# EAGLE design module_v1 (EAGLE 6.4)
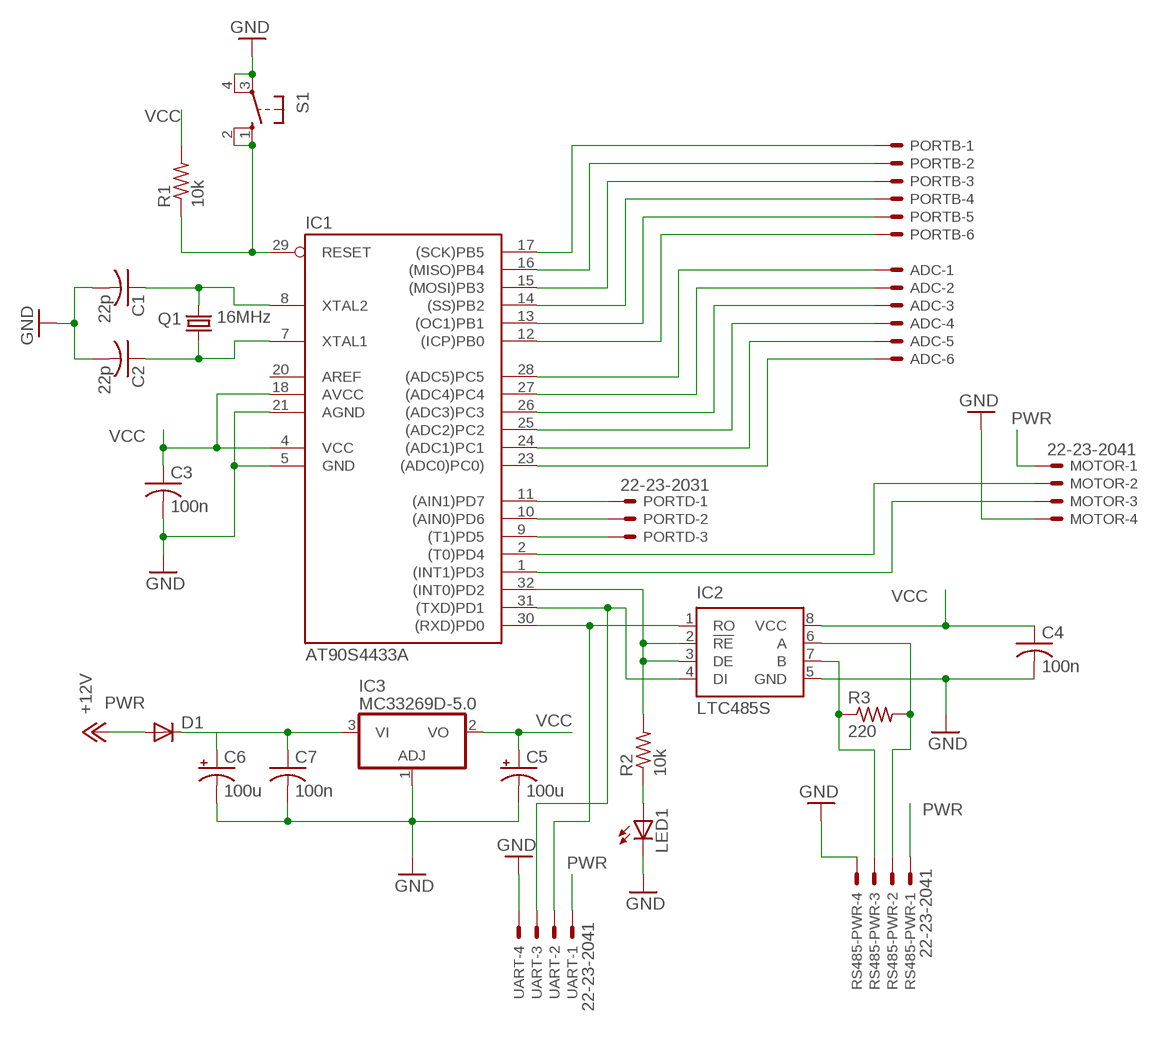
[diagram p0: schematic, sheet 1]

## Parts
ADC  22-23-2061  [22-23-2061]
C1  22p  C-USC0805  [C0805]
C2  22p  C-USC0805  [C0805]
C3  100n  C-USC0805  [C0805]
C4  100n  C-USC0805  [C0805]
C5  100u  CPOL-USD  [PANASONIC_D]
C6  100u  CPOL-USD  [PANASONIC_D]
C7  100n  C-USC0805  [C0805]
D1  DIODE-SMB  [SMB]
IC1  AT90S4433A  [TQFP32-08]
IC2  LTC485S  [SOIC8]
IC3  MC33269D-5.0  [DPACK]
LED1  LEDCHIP-LED0805  [CHIP-LED0805]
MOTOR  22-23-2041  [22-23-2041]
PORTB  22-23-2061  [22-23-2061]
PORTD  22-23-2031  [22-23-2031]
Q1  16MHz  CRYSTALHC49S  [HC49/S]
R1  10k  R-US_R0805  [R0805]
R2  10k  R-US_R0805  [R0805]
R3  220  R-US_R0805  [R0805]
RS485-PWR  22-23-2041  [22-23-2041]
S1  10-XX  [B3F-10XX]
UART  22-23-2041  [22-23-2041]

## Nets
GND: C1.2 C2.2 C3.2 C4.2 C5.- C6.- C7.2 IC1.5(GND) IC1.21(AGND) IC2.5(GND) IC3.1(ADJ) LED1.C MOTOR.4 RS485-PWR.4 S1.3(P) S1.4(P1) UART.4
N$1: IC1.29(RESET) R1.1 S1.1(S) S1.2(S1)
N$2: C2.1 IC1.7(XTAL1) Q1.1
N$3: IC1.32((INT0)PD2) IC2.2(!RE) IC2.3(DE) R2.2
N$4: C1.1 IC1.8(XTAL2) Q1.2
N$5: IC1.30((RXD)PD0) IC2.1(RO) UART.2
N$6: IC1.31((TXD)PD1) IC2.4(DI) UART.3
N$7: IC2.7(B) R3.1 RS485-PWR.3
N$8: IC2.6(A) R3.2 RS485-PWR.2
N$9: LED1.A R2.1
N$10: IC1.1((INT1)PD3) MOTOR.3
N$11: IC1.2((T0)PD4) MOTOR.2
N$12: ADC.6 IC1.23((ADC0)PC0))
N$13: ADC.5 IC1.24((ADC1)PC1)
N$14: ADC.4 IC1.25((ADC2)PC2)
N$15: ADC.3 IC1.26((ADC3)PC3)
N$16: ADC.2 IC1.27((ADC4)PC4)
N$17: ADC.1 IC1.28((ADC5)PC5)
N$18: IC1.12((ICP)PB0) PORTB.6
N$19: IC1.13((OC1)PB1) PORTB.5
N$20: IC1.14((SS)PB2) PORTB.4
N$21: IC1.15((MOSI)PB3) PORTB.3
N$22: IC1.16((MISO)PB4) PORTB.2
N$23: IC1.17((SCK)PB5) PORTB.1
N$24: C6.+ C7.1 D1.C IC3.3(VI)
N$25: IC1.9((T1)PD5) PORTD.3
N$26: IC1.10((AIN0)PD6) PORTD.2
N$27: IC1.11((AIN1)PD7) PORTD.1
PWR: D1.A MOTOR.1 RS485-PWR.1 UART.1 ; supply symbol labelled +12V
VCC: C3.1 C4.1 C5.+ IC1.4(VCC) IC1.18(AVCC) IC2.8(VCC) IC3.2(VO) R1.2
Unconnected: IC1.20(AREF)

## Library data of the parts
ADC PORTB = con-molex:22-23-2061: .100" (2.54mm) Center Header - 6 Pin; MF: MOLEX; MPN: 22-23-2061; OC_FARNELL: 1462922; OC_NEWARK: 27C1933
C1-C4 C7 = rcl:C-US: CAPACITOR, American symbol
C5 C6 = rcl:CPOL-US: POLARIZED CAPACITOR, American symbol
D1 = diode:DIODE-: DIODE
IC1 = atmel:AT90S4433: MICROCONTROLLER 4 Kbytes FLASH 128 bytes SRAM 256 bytes EEPROM UART 6-channel 10 bit ADC; OC_FARNELL: unknown; OC_NEWARK: unknown
IC2 = linear-technology:LTC485: Low Power RS485 Interface Transceiver Source: http://www.linear.com/pc/downloadDocument.do?navId=H0,C1,C1007,C1017,P2064,D1718; OC_FARNELL: unknown; OC_NEWARK: unknown
IC3 = linear:MC33269?*: Adjustable Output Low Dropout Voltage Regulator 800 mA Source: http://www.onsemi.com/pub/Collateral/MC33269-D.PDF
LED1 = led:LED: LED OSRAM: - CHIPLED LG R971, LG N971, LY N971, LG Q971, LY Q971, LO R971, LY R971 LH N974, LH R974 LS Q976, LO Q976, LY Q976 LO Q996 - Hyper CHIPLED LW Q18S LB Q993, LB Q99A, LB R99A - SideLED LS A670, LO A670, LY A670, LG A670, LP A670 LB A673, LV A673, LT A673, LW A673 LH A674 LY A675 LS A676, LA A676, LO A676, LY A676, LW A676 LS A679, LY A679, LG A679 - Hyper Micro SIDELED® LS Y876, LA Y876, LO Y876, LY Y876 LT Y87S - SmartLED LW L88C, LW L88S LB L89C, LB L89S, LG L890 LS L89K, LO L89K, LY L89K LS L896, LA L896, LO L896, LY L896 - TOPLED LS T670, LO T670, LY T670, LG T670, LP T670 LSG T670, LSP T670, LSY T670, LOP T670, LYG T670 LG T671, LOG T671, LSG T671 LB T673, LV T673, LT T673, LW T673 LH T674 LS T676, LA T676, LO T676, LY T676, LB T676, LH T676, LSB T676, LW T676 LB T67C, LV T67C, LT T67C, LS T67K, LO T67K, LY T67K, LW E67C LS E67B, LA E67B, LO E67B, LY E67B, LB E67C, LV E67C, LT E67C LW T67C LS T679, LY T679, LG T679 LS T770, LO T770, LY T770, LG T770, LP T770 LB T773, LV T773, LT T773, LW T773 LH T774 LS E675, LA E675, LY E675, LS T675 LS T776, LA T776, LO T776, LY T776, LB T776 LHGB T686 LT T68C, LB T68C - Hyper Mini TOPLED® LB M676 - Mini TOPLED Santana® LG M470 LS M47K, LO M47K, LY M47K Source: http://www.osram.convergy.de LUXEON: - LUMILED® LXK2-PW12-R00, LXK2-PW12-S00, LXK2-PW14-U00, LXK2-PW14-V00 LXK2-PM12-R00, LXK2-PM12-S00, LXK2-PM14-U00 LXK2-PE12-Q00, LXK2-PE12-R00, LXK2-PE12-S00, LXK2-PE14-T00, LXK2-PE14-U00 LXK2-PB12-K00, LXK2-PB12-L00, LXK2-PB12-M00, LXK2-PB14-N00, LXK2-PB14-P00, LXK2-PB14-Q00 LXK2-PR12-L00, LXK2-PR12-M00, LXK2-PR14-Q00, LXK2-PR14-R00 LXK2-PD12-Q00, LXK2-PD12-R00, LXK2-PD12-S00 LXK2-PH12-R00, LXK2-PH12-S00 LXK2-PL12-P00, LXK2-PL12-Q00, LXK2-PL12-R00 Source: www.luxeon.com KINGBRIGHT: KA-3528ASYC Source: www.kingbright.com
MOTOR RS485-PWR UART = con-molex:22-23-2041: .100" (2.54mm) Center Header - 4 Pin; MF: MOLEX; MPN: 22-23-2041; OC_FARNELL: 1462920; OC_NEWARK: 38C0355
PORTD = con-molex:22-23-2031: .100" (2.54mm) Center Header - 3 Pin; MF: MOLEX; MPN: 22-23-2031; OC_FARNELL: 1462950; OC_NEWARK: 30C0862
Q1 = crystal:CRYSTAL: CRYSTAL; OC_FARNELL: 1667008; OC_NEWARK: unknown
R1-R3 = resistor:R-US_: RESISTOR, American symbol
S1 = switch-omron:10-XX: OMRON SWITCH; MPN: B3F-1000; OC_FARNELL: 176432; OC_NEWARK: 36M3542

## Board
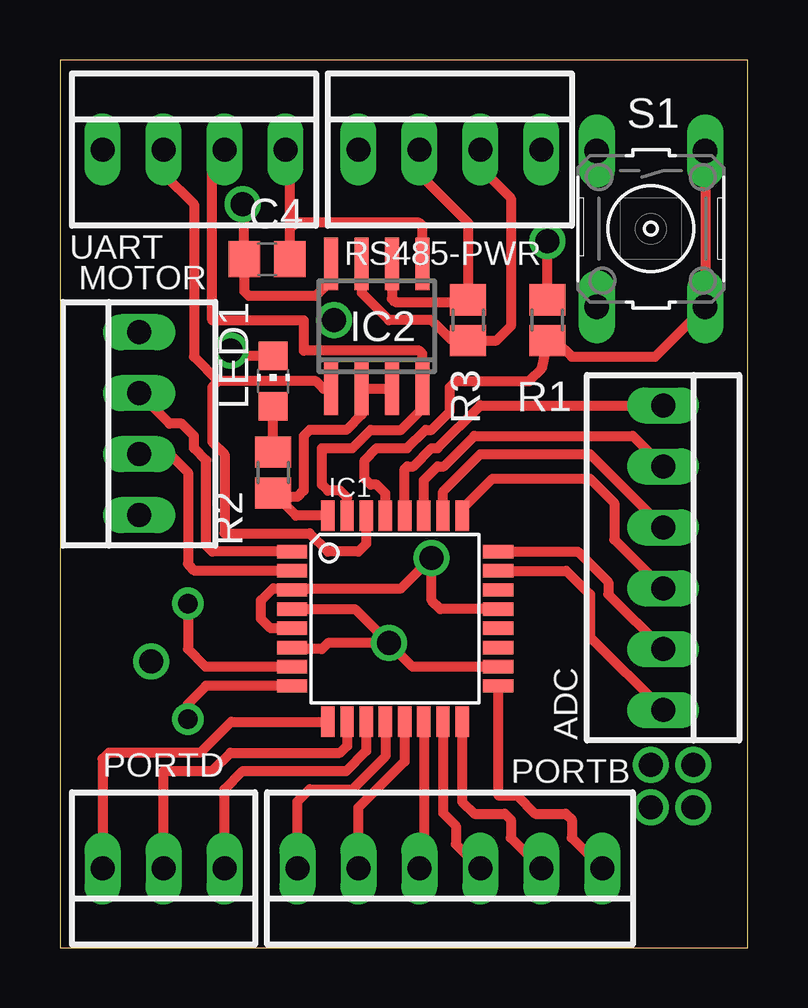
[diagram p1: board, top side]
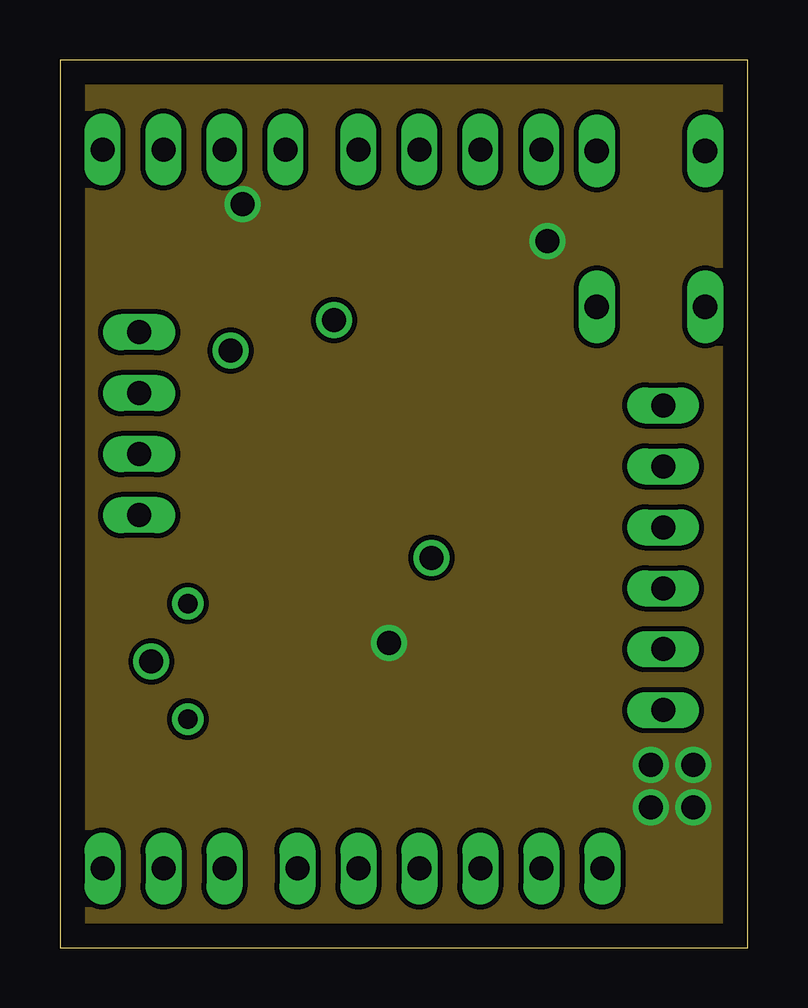
[diagram p2: board, inner layer Route2]
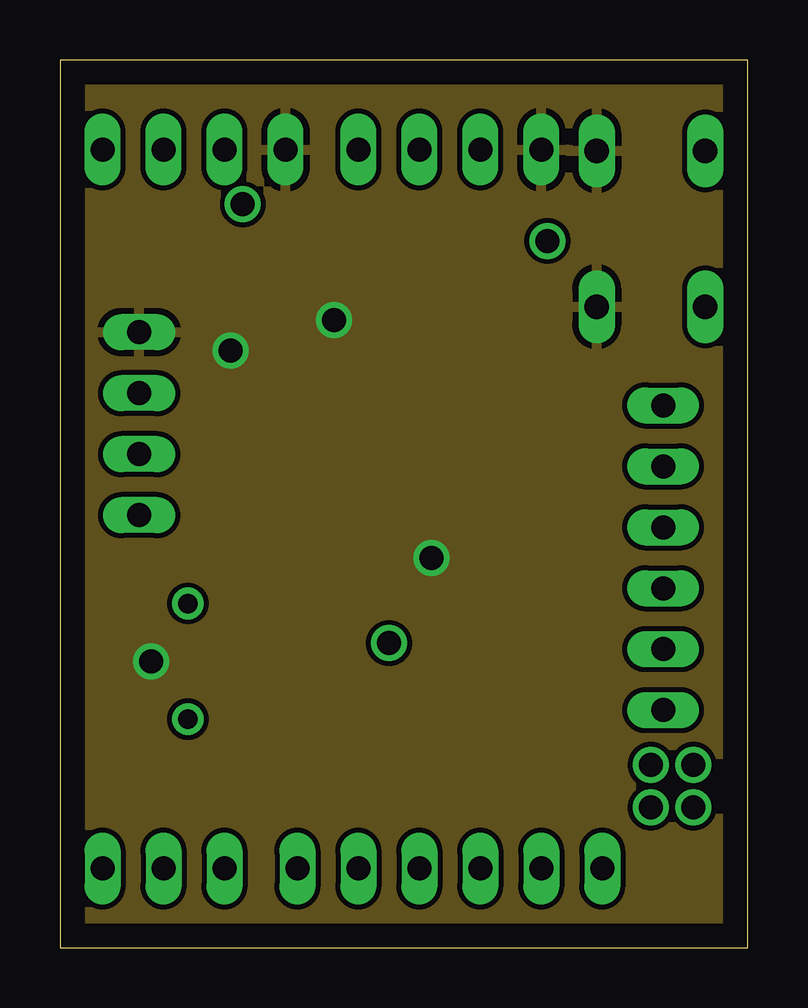
[diagram p3: board, inner layer Route3]
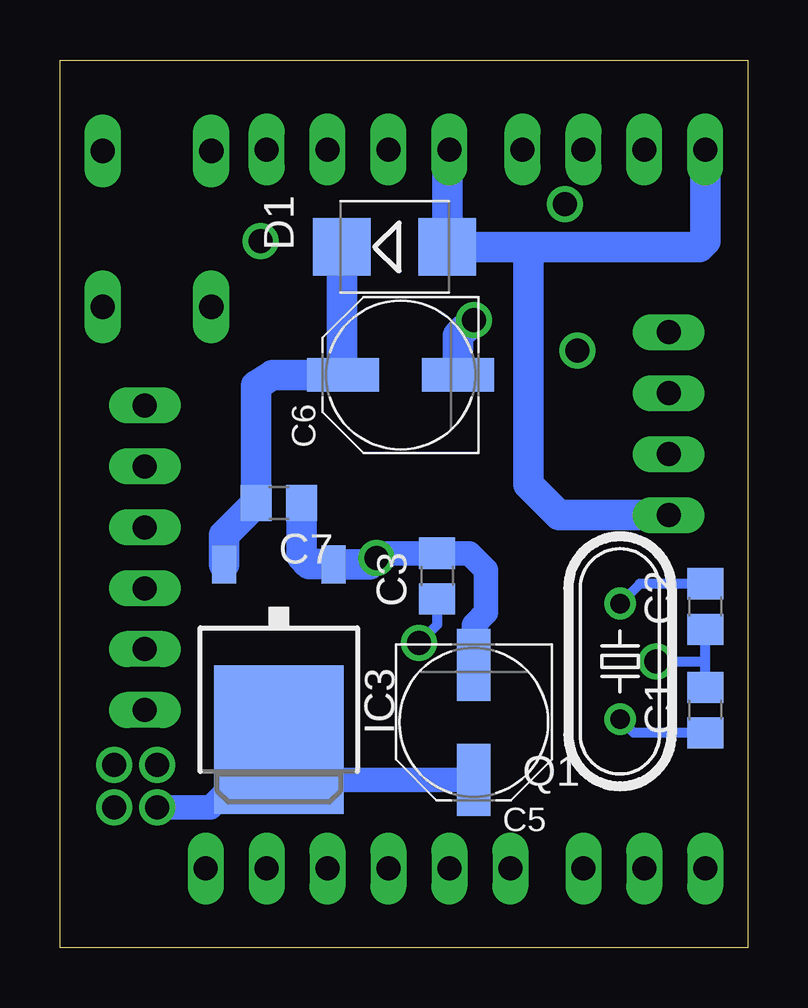
[diagram p4: board, bottom side, seen from below]

Size 28.68 x 37.01 mm. Coordinates in mm from the lower left corner, seen from the top.
Outline: 0,0 28.68,0 28.68,37.01 0,37.01 0,0
Copper layers (1*2*3*16): Top 0.035mm / dielectric 0.35mm / Route2 0.035mm / dielectric 0.35mm / Route3 0.035mm / dielectric 0.35mm / Bottom 0.035mm
Design rules "default *": minimum track width 10mil, minimum drill 24mil, track to track 8mil, track to pad 8mil, pad to pad 8mil, via to via 8mil, smd to smd 8mil, copper to edge 40mil, drill to drill 8mil, minimum pad ring 10mil, minimum via ring 8mil, stop-mask expansion 4mil, vias tented up to drill 0mil, thermal gap 10mil

### Footprints (pad centres in the part's own frame; a part is rotated, then mirrored left to right if it is on the bottom)
22-23-2061 = drill 1 long: 1 -6.35,0; 2 -3.81,0; 3 -1.27,0; 4 1.27,0; 5 3.81,0; 6 6.35,0
C0805 = smd 1.3 x 1.5: 1 -0.95,0; 2 0.95,0
PANASONIC_D = smd 3 x 1.4: + 2.4,0; - -2.4,0
SMB = smd 2.4 x 2.4: A 2.2,0; C -2.2,0
TQFP32-08 = smd 1.27 x 0.559: 1 -4.293,2.8; 2 -4.293,2; 3 -4.293,1.2; 4 -4.293,0.4; 5 -4.293,-0.4; 6 -4.293,-1.2; 7 -4.293,-2; 8 -4.293,-2.8; 17 4.293,-2.8; 18 4.293,-2; 19 4.293,-1.2; 20 4.293,-0.4; 21 4.293,0.4; 22 4.293,1.2; 23 4.293,2; 24 4.293,2.8 | smd 0.559 x 1.27: 9 -2.8,-4.293; 10 -2,-4.293; 11 -1.2,-4.293; 12 -0.4,-4.293; 13 0.4,-4.293; 14 1.2,-4.293; 15 2,-4.293; 16 2.8,-4.293; 25 2.8,4.293; 26 2,4.293; 27 1.2,4.293; 28 0.4,4.293; 29 -0.4,4.293; 30 -1.2,4.293; 31 -2,4.293; 32 -2.8,4.293
SOIC8 = smd 0.6 x 2.2: 1 -1.905,-2.6; 2 -0.635,-2.6; 3 0.635,-2.6; 4 1.905,-2.6; 5 1.905,2.6; 6 0.635,2.6; 7 -0.635,2.6; 8 -1.905,2.6
DPACK = smd 1 x 1.6: 1 -2.28,-4.8; 3 2.28,-4.8 | smd 5.4 x 6.2: 2 0,2.5
CHIP-LED0805 = smd 1.2 x 1.2: A 0,-1.05; C 0,1.05
22-23-2041 = drill 1 long: 1 -3.81,0; 2 -1.27,0; 3 1.27,0; 4 3.81,0
22-23-2031 = drill 1 long: 1 -2.54,0; 2 0,0; 3 2.54,0
HC49/S = drill 0.813: 1 -2.413,0; 2 2.413,0
R0805 = smd 1.3 x 1.5: 1 -0.85,0; 2 0.85,0
B3F-10XX = drill 1.016 long: 1 -3.251,2.261; 2 3.251,2.261; 3 -3.251,-2.261; 4 3.251,-2.261

### Placement (x,y rotation side)
ADC  25.15,16.26 270 top
C1  1.78,9.91 90 bottom
C2  1.78,14.22 270 bottom
C3  12.95,15.49 90 bottom
C4  8.64,28.7 0 top
C5  11.43,9.4 270 bottom
C6  14.48,23.88 180 bottom
C7  19.56,18.54 0 bottom
D1  14.73,29.21 0 bottom
IC1  13.97,13.72 0 top
IC2  13.21,25.91 0 top
IC3  19.56,11.18 180 bottom
LED1  8.89,23.62 0 top
MOTOR  3.3,21.84 90 top
PORTB  16.26,3.3 180 top
PORTD  4.32,3.3 180 top
Q1  5.33,11.94 270 bottom
R1  20.32,26.16 90 top
R2  8.89,19.81 270 top
R3  17.02,26.16 90 top
RS485-PWR  16.26,33.27 0 top
S1  24.64,29.97 270 top
UART  5.59,33.27 0 top

### Tracks (layer width: path | path; a pad name or v marks a point on that pad's centre or on a via)
GND  (via drill 1)
  Top 0.406: LED1.C 7.33,24.67 v7.11,24.89 | C4.2 9.59,29.97 | 9.59,29.97 9.59,33.09 UART.4 | IC2.5 15.11,30.1 14.99,30.23 9.84,30.23 9.59,29.97 | IC1.5 8.78,13.32 8.38,13.72 8.38,14.48 8.89,14.99 14.22,14.99 v15.49,16.26 15.49,14.48 15.86,14.12 IC1.21
  Bottom 0.406: C1.2 1.78,11.94 | 1.78,11.94 C2.2 | v3.81,11.94 1.78,11.94
  Bottom 1.016: 17.78,16 17.3,16 IC3.1 | v15.49,16.26 15.31,16.44 C3.2 11.62,16.44 10.92,15.75 10.92,13.97 11.43,13.46 C5.-
  Bottom 1.27: C7.2 18.61,16.32 18.29,16 17.78,16 | IC3.1 15.77,15.98 v15.49,16.26 | C6.- 12.08,25.51 v11.43,26.16
  pour Route3: 0,37.08 28.45,37.08 28.45,0 0,0
N$1
  Top 0.406: IC1.29 13.57,18.94 13.21,19.3 12.95,19.3 12.7,19.56 12.7,20.32 13.21,20.83 14.48,20.83 15.24,21.59 15.49,21.59 16.26,22.35 16.26,23.37 16.51,23.62 19.56,23.62 20.07,24.13 R1.1 20.66,25.31 21.34,24.64 24.82,24.64 S1.2 S1.1
N$2
  Top 0.406: Q1.1 5.33,12.45 6.06,11.72 IC1.7
  Bottom 0.406: C2.1 4.51,15.17 Q1.1
N$3
  Top 0.406: IC2.3 IC2.2 12.57,22.23 11.94,21.59 10.41,21.59 10.16,21.34 10.16,19.05 9.91,18.8 9.06,18.8 R2.2 9.84,18.01 IC1.32
N$4
  Top 0.406: Q1.2 5.33,10.16 6.09,10.92 IC1.8
  Bottom 0.406: C1.1 4.76,8.96 Q1.2
N$5
  Top 0.406: IC1.30 12.77,16.83 12.45,16.51 11.18,16.51 10.41,17.27 6.86,17.27 6.86,20.57 6.35,21.08 6.35,23.37 6.6,23.62 | IC2.1 10.98,23.31 10.67,23.62 6.6,23.62 | UART.2 4.32,32.26 5.59,30.99 5.59,24.64 6.6,23.62
N$6
  Top 0.406: IC1.31 11.97,18.76 11.68,19.05 11.18,19.05 10.92,19.3 10.92,20.83 12.19,20.83 12.95,21.59 14.22,21.59 15.11,22.48 IC2.4 15.11,24.77 14.99,24.89 10.16,24.89 10.16,26.16 6.35,26.16 6.35,32.77 UART.3
N$7
  Top 0.406: RS485-PWR.3 17.53,32.51 18.8,31.24 18.8,25.91 18.2,25.31 R3.1 16.34,25.31 15.49,26.16 13.72,26.16 12.57,27.3 IC2.7
N$8
  Top 0.406: IC2.6 13.84,27.05 13.97,26.92 16.93,26.92 R3.2 17.02,30.23 14.99,32.26 RS485-PWR.2
N$9
  Top 0.406: R2.1 LED1.A
N$10
  Top 0.406: IC1.1 6.34,16.52 6.1,16.76 6.1,20.32 5.59,20.83 5.59,21.34 5.08,21.84 4.57,21.84 MOTOR.3
N$11
  Top 0.406: MOTOR.2 4.57,20.57 5.33,19.81 5.33,16 5.62,15.72 IC1.2
N$12
  Top 0.406: IC1.23 21.11,15.72 22.1,14.73 22.1,12.95 ADC.6
N$13
  Top 0.406: IC1.24 21.58,16.52 22.86,15.24 22.86,14.73 ADC.5
N$14
  Top 0.406: IC1.25 16.77,18.29 18.03,19.56 22.1,19.56 23.11,18.54 23.11,17.02 ADC.4
N$15
  Top 0.406: IC1.26 15.97,19.02 17.53,20.57 22.1,20.57 ADC.3
N$16
  Top 0.406: IC1.27 15.17,19.49 15.75,20.07 16,20.07 17.27,21.34 23.88,21.34 ADC.2
N$17
  Top 0.406: IC1.28 14.37,19.96 14.48,20.07 14.73,20.07 15.49,20.83 15.75,20.83 17.53,22.61 ADC.1
N$18
  Top 0.406: PORTB.6 9.91,6.1 10.41,6.6 12.19,6.6 13.57,7.98 IC1.12
N$19
  Top 0.406: PORTB.5 12.45,5.84 14.37,7.77 IC1.13
N$20
  Top 0.406: IC1.14 15.17,3.49 PORTB.4
N$21
  Top 0.406: IC1.15 15.97,5.62 16.51,5.08 16.51,4.32 PORTB.3
N$22
  Top 0.406: IC1.16 16.77,6.09 17.27,5.59 18.54,5.59 18.8,5.33 18.8,4.57 PORTB.2
N$23
  Top 0.406: IC1.17 18.26,6.38 18.29,6.35 19.05,6.35 19.81,5.59 21.08,5.59 21.34,5.33 21.34,4.57 PORTB.1
N$24
  Bottom 1.27: D1.C 16.93,24.44 C6.+ 19.81,23.88 20.51,23.43 C7.1 21.84,17.21 IC3.3
N$25
  Top 0.406: PORTD.3 1.78,7.87 2.03,8.13 5.84,8.13 7.14,9.42 IC1.9
N$26
  Top 0.406: PORTD.2 4.32,7.37 6.35,7.37 7.11,8.13 11.68,8.13 11.97,8.41 IC1.10
N$27
  Top 0.406: PORTD.1 6.86,6.6 7.62,7.37 11.94,7.37 12.77,8.2 IC1.11
PWR
  Bottom 1.27: RS485-PWR.1 12.53,33.19 D1.A 9.14,29.21 | UART.1 1.78,29.46 2.03,29.21 9.14,29.21 | MOTOR.1 7.87,18.03 9.14,19.3 9.14,29.21
VCC  (via drill 1)
  Top 0.406: v7.62,30.99 7.69,30.67 C4.1 7.69,27.37 7.87,27.18 10.67,27.18 11.3,27.81 IC2.8 | R1.2 v20.32,29.46 | v13.72,12.7 11.18,12.7 10.92,12.45 9.4,12.45 | IC1.4 12.3,14.12 v13.72,12.7 | IC1.18 14.7,11.72 v13.72,12.7
  Bottom 0.406: C3.1 12.95,13.46 v13.72,12.7
  Bottom 1.016: C5.+ 17.88,7 IC3.2 22.39,5.84 v24.64,5.84
  other vias: 24.64,7.62 26.42,7.62 26.42,5.84
  pour Route2: 0,37.08 28.45,37.08 28.45,0 0,0